# EAGLE design Board_UV V 0.1 (EAGLE 9.5.0)
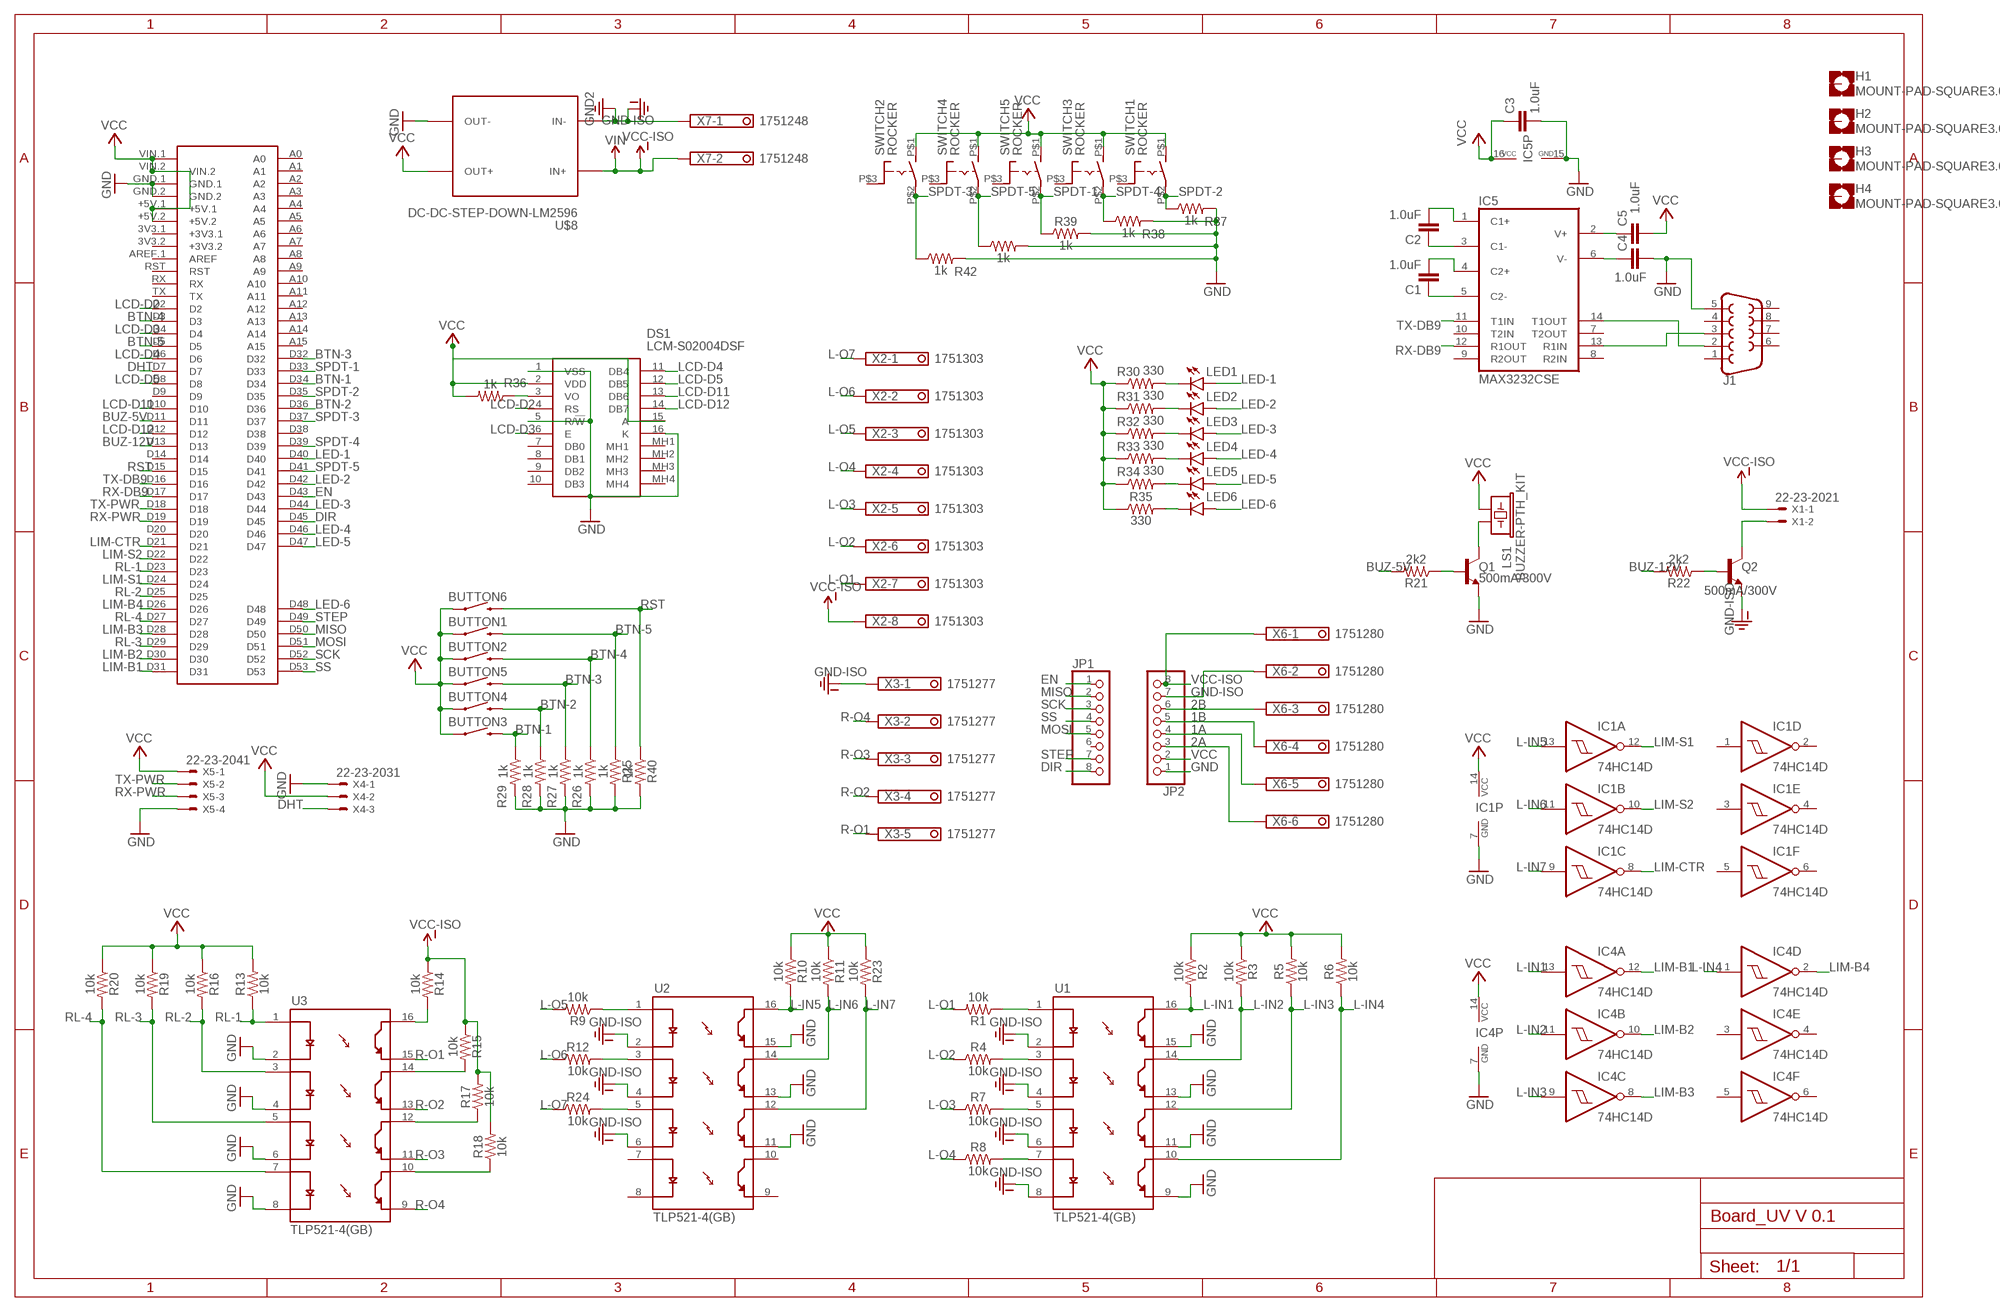
[diagram p0: schematic, sheet 1]

## Parts
BUTTON1  MOMENTARY-SWITCH-SPST-PTH-12MM  [TACTILE_SWITCH_PTH_12MM]
BUTTON2  MOMENTARY-SWITCH-SPST-PTH-12MM  [TACTILE_SWITCH_PTH_12MM]
BUTTON3  MOMENTARY-SWITCH-SPST-PTH-12MM  [TACTILE_SWITCH_PTH_12MM]
BUTTON4  MOMENTARY-SWITCH-SPST-PTH-12MM  [TACTILE_SWITCH_PTH_12MM]
BUTTON5  MOMENTARY-SWITCH-SPST-PTH-12MM  [TACTILE_SWITCH_PTH_12MM]
BUTTON6  MOMENTARY-SWITCH-SPST-PTH-12MM  [TACTILE_SWITCH_PTH_12MM]
C1  1.0uF  1.0UF-0603-16V-10%-X7R  [0603]
C2  1.0uF  1.0UF-0603-16V-10%-X7R  [0603]
C3  1.0uF  1.0UF-0603-16V-10%-X7R  [0603]
C4  1.0uF  1.0UF-0603-16V-10%-X7R  [0603]
C5  1.0uF  1.0UF-0603-16V-10%-X7R  [0603]
DS1  LCM-S02004DSF  [LCMS02004DSF]
H1  MOUNT-PAD-SQUARE3.0  [3,0-PAD-SQUARE]
H2  MOUNT-PAD-SQUARE3.0  [3,0-PAD-SQUARE]
H3  MOUNT-PAD-SQUARE3.0  [3,0-PAD-SQUARE]
H4  MOUNT-PAD-SQUARE3.0  [3,0-PAD-SQUARE]
IC1  74HC14D  [SO14]
IC4  74HC14D  [SO14]
IC5  MAX3232CSE  [SO16]
J1  DB9FEMALE  [DB9]
JP1  PINHD-1X8  [1X08]
JP2  PINHD-1X8  [1X08]
LED1  LED5MM  [LED5MM]
LED2  LED5MM  [LED5MM]
LED3  LED5MM  [LED5MM]
LED4  LED5MM  [LED5MM]
LED5  LED5MM  [LED5MM]
LED6  LED5MM  [LED5MM]
LS1  BUZZER-PTH_KIT  [BUZZER-12MM-KIT]
Q1  500mA/300V  TRANS_NPN-MMBTA42  [SOT23-3]
Q2  500mA/300V  TRANS_NPN-MMBTA42  [SOT23-3]
R1  10k  10KOHM-0603-1/10W-1%  [0603]
R2  10k  10KOHM-0603-1/10W-1%  [0603]
R3  10k  10KOHM-0603-1/10W-1%  [0603]
R4  10k  10KOHM-0603-1/10W-1%  [0603]
R5  10k  10KOHM-0603-1/10W-1%  [0603]
R6  10k  10KOHM-0603-1/10W-1%  [0603]
R7  10k  10KOHM-0603-1/10W-1%  [0603]
R8  10k  10KOHM-0603-1/10W-1%  [0603]
R9  10k  10KOHM-0603-1/10W-1%  [0603]
R10  10k  10KOHM-0603-1/10W-1%  [0603]
R11  10k  10KOHM-0603-1/10W-1%  [0603]
R12  10k  10KOHM-0603-1/10W-1%  [0603]
R13  10k  10KOHM-0603-1/10W-1%  [0603]
R14  10k  10KOHM-0603-1/10W-1%  [0603]
R15  10k  10KOHM-0603-1/10W-1%  [0603]
R16  10k  10KOHM-0603-1/10W-1%  [0603]
R17  10k  10KOHM-0603-1/10W-1%  [0603]
R18  10k  10KOHM-0603-1/10W-1%  [0603]
R19  10k  10KOHM-0603-1/10W-1%  [0603]
R20  10k  10KOHM-0603-1/10W-1%  [0603]
R21  2k2  10KOHM-0603-1/10W-1%  [0603]
R22  2k2  10KOHM-0603-1/10W-1%  [0603]
R23  10k  10KOHM-0603-1/10W-1%  [0603]
R24  10k  10KOHM-0603-1/10W-1%  [0603]
R25  1k  10KOHM-0603-1/10W-1%  [0603]
R26  1k  10KOHM-0603-1/10W-1%  [0603]
R27  1k  10KOHM-0603-1/10W-1%  [0603]
R28  1k  10KOHM-0603-1/10W-1%  [0603]
R29  1k  10KOHM-0603-1/10W-1%  [0603]
R30  330  10KOHM-0603-1/10W-1%  [0603]
R31  330  10KOHM-0603-1/10W-1%  [0603]
R32  330  10KOHM-0603-1/10W-1%  [0603]
R33  330  10KOHM-0603-1/10W-1%  [0603]
R34  330  10KOHM-0603-1/10W-1%  [0603]
R35  330  10KOHM-0603-1/10W-1%  [0603]
R36  1k  10KOHM-0603-1/10W-1%  [0603]
R37  1k  10KOHM-0603-1/10W-1%  [0603]
R38  1k  10KOHM-0603-1/10W-1%  [0603]
R39  1k  10KOHM-0603-1/10W-1%  [0603]
R40  1k  10KOHM-0603-1/10W-1%  [0603]
R41  1k  10KOHM-0603-1/10W-1%  [0603]
R42  1k  10KOHM-0603-1/10W-1%  [0603]
SWITCH1  ROCKER  [320-916]
SWITCH2  ROCKER  [320-916]
SWITCH3  ROCKER  [320-916]
SWITCH4  ROCKER  [320-916]
SWITCH5  ROCKER  [320-916]
U1  TLP521-4(GB)  [DIP762W50P254L2007H485Q16]
U2  TLP521-4(GB)  [DIP762W50P254L2007H485Q16]
U3  TLP521-4(GB)  [DIP762W50P254L2007H485Q16]
U$1  MEGA2560_MIKRO  [MEGA2560_MIKRO]
U$8  DC-DC-STEP-DOWN-LM2596  [DC-DC-STEP-DOWN-LM2596]
X1  22-23-2021  [22-23-2021]
X2  1751303  [1751303]
X3  1751277  [1751277]
X4  22-23-2031  [22-23-2031]
X5  22-23-2041  [22-23-2041]
X6  1751280  [1751280]
X7  1751248  [1751248]

## Nets
1A: JP2.4 X6.5
1B: JP2.5 X6.4
2A: JP2.3 X6.6
2B: JP2.6 X6.3
BTN-1: BUTTON3.3 R29.1 U$1.D34
BTN-2: BUTTON4.3 R28.1 U$1.D36
BTN-3: BUTTON5.3 R27.1 U$1.D32
BTN-4: BUTTON2.3 R26.1 U$1.D3
BTN-5: BUTTON1.3 R25.1 U$1.D5
BUZ-5V: R21.2 U$1.D11
BUZ-12V: R22.2 U$1.D13
DHT: U$1.D7 X4.3
DIR: JP1.8 U$1.D45
EN: JP1.1 U$1.D43
GND: C3.2 C4.2 DS1.1(VSS) DS1.5(R/!W) DS1.16(K) IC1.7(P:GND) IC4.7(P:GND) IC5.15(GND) J1.5 JP2.1 Q1.2(E) R25.2 R26.2 R27.2 R28.2 R29.2 R37.2 R38.2 R39.2 R40.2 R41.2 R42.2 U1.9(ET4) U1.11(ET3) U1.13(ET2) U1.15(ET1) U2.11(ET3) U2.13(ET2) U2.15(ET1) U3.2(C1) U3.4(C2) U3.6(C3) U3.8(C4) U$1.GND.1 U$1.GND.2 U$8.OUT- X4.1 X5.4
GND-ISO: JP2.7 Q2.2(E) U1.2(C1) U1.4(C2) U1.6(C3) U1.8(C4) U2.2(C1) U2.4(C2) U2.6(C3) U$8.IN- X3.1 X6.2 X7.1 ; supply symbol labelled GND2
L-IN1: IC4.13(A:I) R2.2 U1.16(CT1)
L-IN2: IC4.11(B:I) R3.2 U1.14(CT2)
L-IN3: IC4.9(C:I) R5.1 U1.12(CT3)
L-IN4: IC4.1(D:I) R6.1 U1.10(CT4)
L-IN5: IC1.13(A:I) R10.2 U2.16(CT1)
L-IN6: IC1.11(B:I) R11.2 U2.14(CT2)
L-IN7: IC1.9(C:I) R23.2 U2.12(CT3)
L-O1: R1.2 X2.7
L-O2: R4.1 X2.6
L-O3: R7.1 X2.5
L-O4: R8.1 X2.4
L-O5: R9.2 X2.3
L-O6: R12.1 X2.2
L-O7: R24.1 X2.1
LCD-D2: DS1.4(RS) U$1.D2
LCD-D3: DS1.6(E) U$1.D4
LCD-D4: DS1.11(DB4) U$1.D6
LCD-D5: DS1.12(DB5) U$1.D8
LCD-D11: DS1.13(DB6) U$1.D10
LCD-D12: DS1.14(DB7) U$1.D12
LED-1: LED1.A U$1.D40
LED-2: LED2.A U$1.D42
LED-3: LED3.A U$1.D44
LED-4: LED4.A U$1.D46
LED-5: LED5.A U$1.D47
LED-6: LED6.A U$1.D48
LIM-B1: IC4.12(A:O) U$1.D31
LIM-B2: IC4.10(B:O) U$1.D30
LIM-B3: IC4.8(C:O) U$1.D28
LIM-B4: IC4.2(D:O) U$1.D26
LIM-CTR: IC1.8(C:O) U$1.D21
LIM-S1: IC1.12(A:O) U$1.D24
LIM-S2: IC1.10(B:O) U$1.D22
MISO: JP1.2 U$1.D50
MOSI: JP1.5 U$1.D51
N$1: C1.1 IC5.5(C2-)
N$2: C4.1 IC5.6(V-)
N$3: C2.1 IC5.3(C1-)
N$4: C2.2 IC5.1(C1+)
N$5: C1.2 IC5.4(C2+)
N$6: IC5.14(T1OUT) J1.2
N$7: C5.1 IC5.2(V+)
N$8: LED1.K(C) R30.2
N$9: LED4.K(C) R33.2
N$10: IC5.13(R1IN) J1.3
N$13: R1.1 U1.1(A1)
N$14: R4.2 U1.3(A2)
N$15: R7.2 U1.5(A3)
N$16: R8.2 U1.7(A4)
N$23: R9.1 U2.1(A1)
N$24: R12.2 U2.3(A2)
N$25: Q1.1(B) R21.1
N$33: R14.2 U3.16(CT1)
N$37: R15.2 U3.14(CT2)
N$38: R17.1 U3.12(CT3)
N$39: R18.1 U3.10(CT4)
N$42: LS1.- Q1.3(C)
N$47: Q2.3(C) X1.2
N$56: DS1.3(VO) R36.1
N$66: Q2.1(B) R22.1
N$69: R24.2 U2.5(A3)
N$89: LED2.K(C) R31.2
N$91: LED3.K(C) R32.2
N$94: LED5.K(C) R34.2
N$96: LED6.K(C) R35.2
R-O1: U3.15(ET1) X3.5
R-O2: U3.13(ET2) X3.4
R-O3: U3.11(ET3) X3.3
R-O4: U3.9(ET4) X3.2
RL-1: R13.1 U3.1(A1) U$1.D23
RL-2: R16.2 U3.3(A2) U$1.D25
RL-3: R19.2 U3.5(A3) U$1.D29
RL-4: R20.2 U3.7(A4) U$1.D27
RST: BUTTON6.3 R40.1 U$1.D15
RX-DB9: IC5.12(R1OUT) U$1.D17
RX-PWR: U$1.D19 X5.3
SCK: JP1.3 U$1.D52
SPDT-1: R39.1 SWITCH5.P$2(P) U$1.D33
SPDT-2: R37.1 SWITCH1.P$2(P) U$1.D35
SPDT-3: R42.1 SWITCH2.P$2(P) U$1.D37
SPDT-4: R38.1 SWITCH3.P$2(P) U$1.D39
SPDT-5: R41.1 SWITCH4.P$2(P) U$1.D41
SS: JP1.4 U$1.D53
STEP: JP1.7 U$1.D49
TX-DB9: IC5.11(T1IN) U$1.D16
TX-PWR: U$1.D18 X5.2
VCC: BUTTON1.1 BUTTON2.1 BUTTON3.1 BUTTON4.1 BUTTON5.1 BUTTON6.1 C3.1 C5.2 DS1.2(VDD) DS1.15(A) IC1.14(P:VCC) IC4.14(P:VCC) IC5.16(VCC) JP2.2 LS1.+ R2.1 R3.1 R5.2 R6.2 R10.1 R11.1 R13.2 R16.1 R19.1 R20.1 R23.1 R30.1 R31.1 R32.1 R33.1 R34.1 R35.1 R36.2 SWITCH1.P$1(S) SWITCH2.P$1(S) SWITCH3.P$1(S) SWITCH4.P$1(S) SWITCH5.P$1(S) U$1.+5V.1 U$1.+5V.2 U$1.VIN.1 U$1.VIN.2 U$8.OUT+ X4.2 X5.1
VCC-ISO: JP2.8 R14.1 R15.1 R17.2 R18.2 U$8.IN+ X1.1 X2.8 X6.1 X7.2 ; supply symbol labelled VIN
Unconnected: DS1.7(DB0) DS1.8(DB1) DS1.9(DB2) DS1.10(DB3) DS1.MH1 DS1.MH2 DS1.MH3 DS1.MH4 H1.B3,0(MOUNT) H2.B3,0(MOUNT) H3.B3,0(MOUNT) H4.B3,0(MOUNT) IC1.1(D:I) IC1.2(D:O) IC1.3(E:I) IC1.4(E:O) IC1.5(F:I) IC1.6(F:O) IC4.3(E:I) IC4.4(E:O) IC4.5(F:I) IC4.6(F:O) IC5.7(T2OUT) IC5.8(R2IN) IC5.9(R2OUT) IC5.10(T2IN) J1.1 J1.4 J1.6 J1.7 J1.8 J1.9 JP1.6 SWITCH1.P$3(NC) SWITCH2.P$3(NC) SWITCH3.P$3(NC) SWITCH4.P$3(NC) SWITCH5.P$3(NC) U2.7(A4) U2.8(C4) U2.9(ET4) U2.10(CT4) U$1.3V3.1(+3V3.1) U$1.3V3.2(+3V3.2) U$1.A0 U$1.A1 U$1.A2 U$1.A3 U$1.A4 U$1.A5 U$1.A6 U$1.A7 U$1.A8 U$1.A9 U$1.A10 U$1.A11 U$1.A12 U$1.A13 U$1.A14 U$1.A15 U$1.AREF.1(AREF) U$1.D9 U$1.D14 U$1.D20 U$1.D38 U$1.RST U$1.RX U$1.TX

## Library data of the parts
BUTTON1-BUTTON6 = SparkFun-Switches:MOMENTARY-SWITCH-SPST: Momentary Switch (Pushbutton) - SPST Normally-open (NO) SPST momentary switches (buttons, pushbuttons). Variants PTH-12MM - 12mm square, through-hole Momentary Pushbutton Switch - 12mm Square <https://www.sparkfun.com/products/9190> (COM-09190) PTH-6.0MM, PTH-6.0MM-KIT - 6.0mm square, through-hole Mini Pushbutton Switch <https://www.sparkfun.com/products/97> (COM-00097) KIT package intended for soldering kit's - only one side of pads' copper is exposed. PTH-RIGHT-ANGLE-KIT - Right-angle, through-hole Right Angle Tactile Button <https://www.sparkfun.com/products/10791> - Used on SparkFun BigTime Watch Kit <https://www.sparkfun.com/products/11734> SMD-12MM - 12mm square, surface-mount Tactile Button - SMD (12mm) <https://www.sparkfun.com/products/12993> (COM-12993) Used on SparkFun PicoBoard <https://www.sparkfun.com/products/11888> SMD-4.5MM - 4.5mm Square Trackball Switch Used on SparkFun Blackberry Trackballer Breakout <https://www.sparkfun.com/products/13169> SMD-4.6MMX2.8MM - 4.60mm x 2.80mm, surface mount Used on SparkFun SAMD21 Mini Breakout <https://www.sparkfun.com/products/13664> SMD-5.2MM, SMD-5.2-REDUNDANT - 5.2mm square, surface-mount Mini Pushbutton Switch - SMD <https://www.sparkfun.com/products/8720> (COM-08720) Used on Arduino Pro Mini <https://www.sparkfun.com/products/11114> REDUNDANT package connects both switch circuits together SMD-6.0X3.5MM - 6.0 x 3.5mm, surface mount Momentary Reset Switch SMD <https://www.sparkfun.com/products/8229> (COM-08229) SMD-6.2MM-TALL - 6.2mm square, surface mount Tactile Button - SMD (6mm) <https://www.sparkfun.com/products/12992> Used on SparkFun Digital Sandbox <https://www.sparkfun.com/products/12651> SMD-RIGHT-ANGLE - Right-angle, surface mount Used on SparkFun Block for Intel® Edison - Arduino <https://www.sparkfun.com/products/13036>; PROD_ID: SWCH-09185; SF_SKU: COM-09190
C1-C5 = SparkFun-Capacitors:1.0UF: 1µF ceramic capacitors A capacitor is a passive two-terminal electrical component used to store electrical energy temporarily in an electric field.; PROD_ID: CAP-13930
DS1 = LCM-S02004DSF:LCM-S02004DSF: Lumex LCM-S02004DSF Alphanumeric LCD Display, 4 Rows by 20 Characters, Transflective Source: Datasheet <https://media.digikey.com/pdf/Data Sheets/Lumex PDFs/LCM-x02004Dxx_Dwg.PDF>; ALLIED_NUMBER: 70127579; ALLIED_PRICE-STOCK: https://www.alliedelec.com/lumex-lcm-s02004dsf/70127579/; DESCRIPTION: Lumex LCM-S02004DSF Alphanumeric LCD Display, 4 Rows by 20 Characters, Transflective; HEIGHT: 10.3mm; MANUFACTURER_NAME: Lumex; MANUFACTURER_PART_NUMBER: LCM-S02004DSF; MOUSER_PART_NUMBER: 696-LCM-S02004DSF; MOUSER_PRICE-STOCK: https://www.mouser.com/Search/Refine.aspx?Keyword=696-LCM-S02004DSF; RS_PART_NUMBER: 8885720; RS_PRICE-STOCK: http://uk.rs-online.com/web/p/products/8885720
H1-H4 = holes:MOUNT-PAD-SQUARE: MOUNTING PAD, square
IC1 IC4 = 74xx-eu:74*14: Hex schmitt trigger INVERTER
IC5 = maxim:MAX3232*: True RS-232 Transceivers 3.0V to 5.5V, Low-Power up to 1Mbps, Using Four 0.1µF External Capacitors Source: http://pdfserv.maxim-ic.com/en/ds/MAX3222-MAX3241.pdf; MPN: MAX3232CSE; OC_FARNELL: 9725490; OC_NEWARK: 90C2890
J1 = SparkFun-Connectors:DB9: DB9 Connector Standard DB9 (D-Sub 9) serial connector. Can be used for CAN bus as well as RS485 and RS232. Footprint production proven. Here is the female version connector we sell at SparkFun: 9 Pin Female Serial Connector - PCB Mount <https://www.sparkfun.com/products/429> (PRT-00429) This connector has been used on the following SparkFun products: SparkFun RS232 Shifter - SMD <https://www.sparkfun.com/products/449> (PRT-00449) SparkFun RS232 Shifter SMD (No DB9) <https://www.sparkfun.com/products/8780> (PRT-08780); PROD_ID: CONN-08194
JP1 JP2 = pinhead:PINHD-1X8: PIN HEADER
LED1-LED6 = led:LED: LED OSRAM: - CHIPLED LG R971, LG N971, LY N971, LG Q971, LY Q971, LO R971, LY R971 LH N974, LH R974 LS Q976, LO Q976, LY Q976 LO Q996 - Hyper CHIPLED LW Q18S LB Q993, LB Q99A, LB R99A - SideLED LS A670, LO A670, LY A670, LG A670, LP A670 LB A673, LV A673, LT A673, LW A673 LH A674 LY A675 LS A676, LA A676, LO A676, LY A676, LW A676 LS A679, LY A679, LG A679 - Hyper Micro SIDELED® LS Y876, LA Y876, LO Y876, LY Y876 LT Y87S - SmartLED LW L88C, LW L88S LB L89C, LB L89S, LG L890 LS L89K, LO L89K, LY L89K LS L896, LA L896, LO L896, LY L896 - TOPLED LS T670, LO T670, LY T670, LG T670, LP T670 LSG T670, LSP T670, LSY T670, LOP T670, LYG T670 LG T671, LOG T671, LSG T671 LB T673, LV T673, LT T673, LW T673 LH T674 LS T676, LA T676, LO T676, LY T676, LB T676, LH T676, LSB T676, LW T676 LB T67C, LV T67C, LT T67C, LS T67K, LO T67K, LY T67K, LW E67C LS E67B, LA E67B, LO E67B, LY E67B, LB E67C, LV E67C, LT E67C LW T67C LS T679, LY T679, LG T679 LS T770, LO T770, LY T770, LG T770, LP T770 LB T773, LV T773, LT T773, LW T773 LH T774 LS E675, LA E675, LY E675, LS T675 LS T776, LA T776, LO T776, LY T776, LB T776 LHGB T686 LT T68C, LB T68C - Hyper Mini TOPLED® LB M676 - Mini TOPLED Santana® LG M470 LS M47K, LO M47K, LY M47K Source: http://www.osram.convergy.de LUXEON: - LUMILED® LXK2-PW12-R00, LXK2-PW12-S00, LXK2-PW14-U00, LXK2-PW14-V00 LXK2-PM12-R00, LXK2-PM12-S00, LXK2-PM14-U00 LXK2-PE12-Q00, LXK2-PE12-R00, LXK2-PE12-S00, LXK2-PE14-T00, LXK2-PE14-U00 LXK2-PB12-K00, LXK2-PB12-L00, LXK2-PB12-M00, LXK2-PB14-N00, LXK2-PB14-P00, LXK2-PB14-Q00 LXK2-PR12-L00, LXK2-PR12-M00, LXK2-PR14-Q00, LXK2-PR14-R00 LXK2-PD12-Q00, LXK2-PD12-R00, LXK2-PD12-S00 LXK2-PH12-R00, LXK2-PH12-S00 LXK2-PL12-P00, LXK2-PL12-Q00, LXK2-PL12-R00 Source: www.luxeon.com KINGBRIGHT: KA-3528ASYC Source: www.kingbright.com
LS1 = SparkFun-Electromechanical:BUZZER: Buzzer Small round buzzers that operate around the audible 2kHz range. You can use these as speakers to create simple music or user interfaces. Variant Overview: PTH - Mini Speaker - PC Mount 12mm 2.048kHz <https://www.sparkfun.com/products/7950> PTH_KIT - Mini Speaker - PC Mount 12mm 2.048kHz <https://www.sparkfun.com/products/7950> KIT simplifies soldering by adding stop mask to one side of the pads. PTH_NO_SILK - Mini Speaker - PC Mount 12mm 2.048kHz <https://www.sparkfun.com/products/7950> No silkscreen indicator of buzzer outline. PTH_KIT_NO_SILK - Mini Speaker - PC Mount 12mm 2.048kHz <https://www.sparkfun.com/products/7950> KIT package w/o silkscreen SMD - Buzzer Audio Magnetic (CCV-084B16) SMD buzzer used on, e.g. the LilyPad Buzzer <https://www.sparkfun.com/products/8463> and RFID USB Reader <https://www.sparkfun.com/products/9963>. SMD_KIT - Buzzer Audio Magnetic (CCV-084B16) SMD Buzzer with elongated pins to make soldering easier. Used on the SparkFun Simon Says - Surface Mount Soldering Kit <https://www.sparkfun.com/products/10935>.; PROD_ID: COMP-08253; SF_SKU: COM-07950
Q1 Q2 = SparkFun-DiscreteSemi:TRANS_NPN: NPN transistor Current controlled devices typically used to amplify current or used as a switch. BC547 - COM-08928 <http://www.sparkfun.com/products/8928> (TO-92 45V 100mA) (1.Collector 2.Base 3.Emitter) 2N3904 - COM-00521 <http://www.sparkfun.com/products/521> (TO-92 40V 200mA) (1.Emitter 2.Base 3.Collector) P2N2222A - COM-12852 <http://www.sparkfun.com/products/12852> (TO-92 40V 600mA) (1.Collector 2.Base 3.Emitter); PROD_ID: TRANS-09116
R1-R20 R23 R24 = SparkFun-Resistors:10KOHM: 10kΩ resistor A resistor is a passive two-terminal electrical component that implements electrical resistance as a circuit element. Resistors act to reduce current flow, and, at the same time, act to lower voltage levels within circuits. - Wikipedia; PROD_ID: RES-00824
R21 R22 R25-R42 = SparkFun-Resistors:10KOHM: 10kΩ resistor A resistor is a passive two-terminal electrical component that implements electrical resistance as a circuit element. Resistors act to reduce current flow, and, at the same time, act to lower voltage levels within circuits. - Wikipedia; PROD_ID: RES-00824; VALUE: 10k
SWITCH1-SWITCH5 = rocker sw:ROCKER
U1-U3 = TLP521-4_GB_:TLP521-4(GB): Optocoupler, Quad, Transistor o/p; AVAILABILITY: Unavailable; DESCRIPTION: Optocoupler, Quad, Transistor o/p; MF: Toshiba; MP: TLP521-4_GB_; PACKAGE: DIP-16 Toshiba; PRICE: None
U$1 = MIKRO_MEGA2560:MEGA2560_MIKRO: Arduino Mega2560 pro robotDyn, create by mikroavr.com
U$8 = diy-modules:DC-DC-STEP-DOWN-LM2596: DC/DC Step-Down Regulator based on LM2596-ADJ chip LM2596 datasheet available here: http://www.ti.com/lit/ds/symlink/lm2596.pdf Click here to find device on ebay.com <http://www.ebay.com/sch/lm2596+power+regulator>
X1 = con-molex:22-23-2021: .100" (2.54mm) Center Header - 2 Pin; MF: MOLEX; MPN: 22-23-2021; OC_FARNELL: 1462926; OC_NEWARK: 25C3832
X2 = con-phoenix-350:1751303: MKDS 1/ 8-3,5 Printklemme Nennstrom: 10 A Bemessungsspannung: 160 V Raster: 3,5 mm Polzahl: 8 Montageart: Löten Anschlussart: Schraubanschluss Anschlussrichtung vom Leiter zur Platine: 0° Source: http://eshop.phoenixcontact.com .. .pdf; OC_FARNELL: unknown; OC_NEWARK: unknown
X3 = con-phoenix-350:1751277: MKDS 1/ 5-3,5 Printklemme Nennstrom: 10 A Bemessungsspannung: 160 V Raster: 3,5 mm Polzahl: 5 Montageart: Löten Anschlussart: Schraubanschluss Anschlussrichtung vom Leiter zur Platine: 0° Source: http://eshop.phoenixcontact.com .. 1751277.pdf; OC_FARNELL: unknown; OC_NEWARK: unknown
X4 = con-molex:22-23-2031: .100" (2.54mm) Center Header - 3 Pin; MF: MOLEX; MPN: 22-23-2031; OC_FARNELL: 1462950; OC_NEWARK: 30C0862
X5 = con-molex:22-23-2041: .100" (2.54mm) Center Header - 4 Pin; MF: MOLEX; MPN: 22-23-2041; OC_FARNELL: 1462920; OC_NEWARK: 38C0355
X6 = con-phoenix-350:1751280: MKDS 1/ 6-3,5 Printklemme Nennstrom: 10 A Bemessungsspannung: 160 V Raster: 3,5 mm Polzahl: 6 Montageart: Löten Anschlussart: Schraubanschluss Anschlussrichtung vom Leiter zur Platine: 0° Source: http://eshop.phoenixcontact.com .. 1751280.pdf; MPN: 1751280; OC_FARNELL: unknown; OC_NEWARK: 27R1765
X7 = con-phoenix-350:1751248: MKDS 1/ 2-3,5 Printklemme Nennstrom: 10 A Bemessungsspannung: 160 V Raster: 3,5 mm Polzahl: 2 Montageart: Löten Anschlussart: Schraubanschluss Anschlussrichtung vom Leiter zur Platine: 0° Source: http://eshop.phoenixcontact.com .. 1751248.pdf; OC_FARNELL: unknown; OC_NEWARK: unknown

## Board
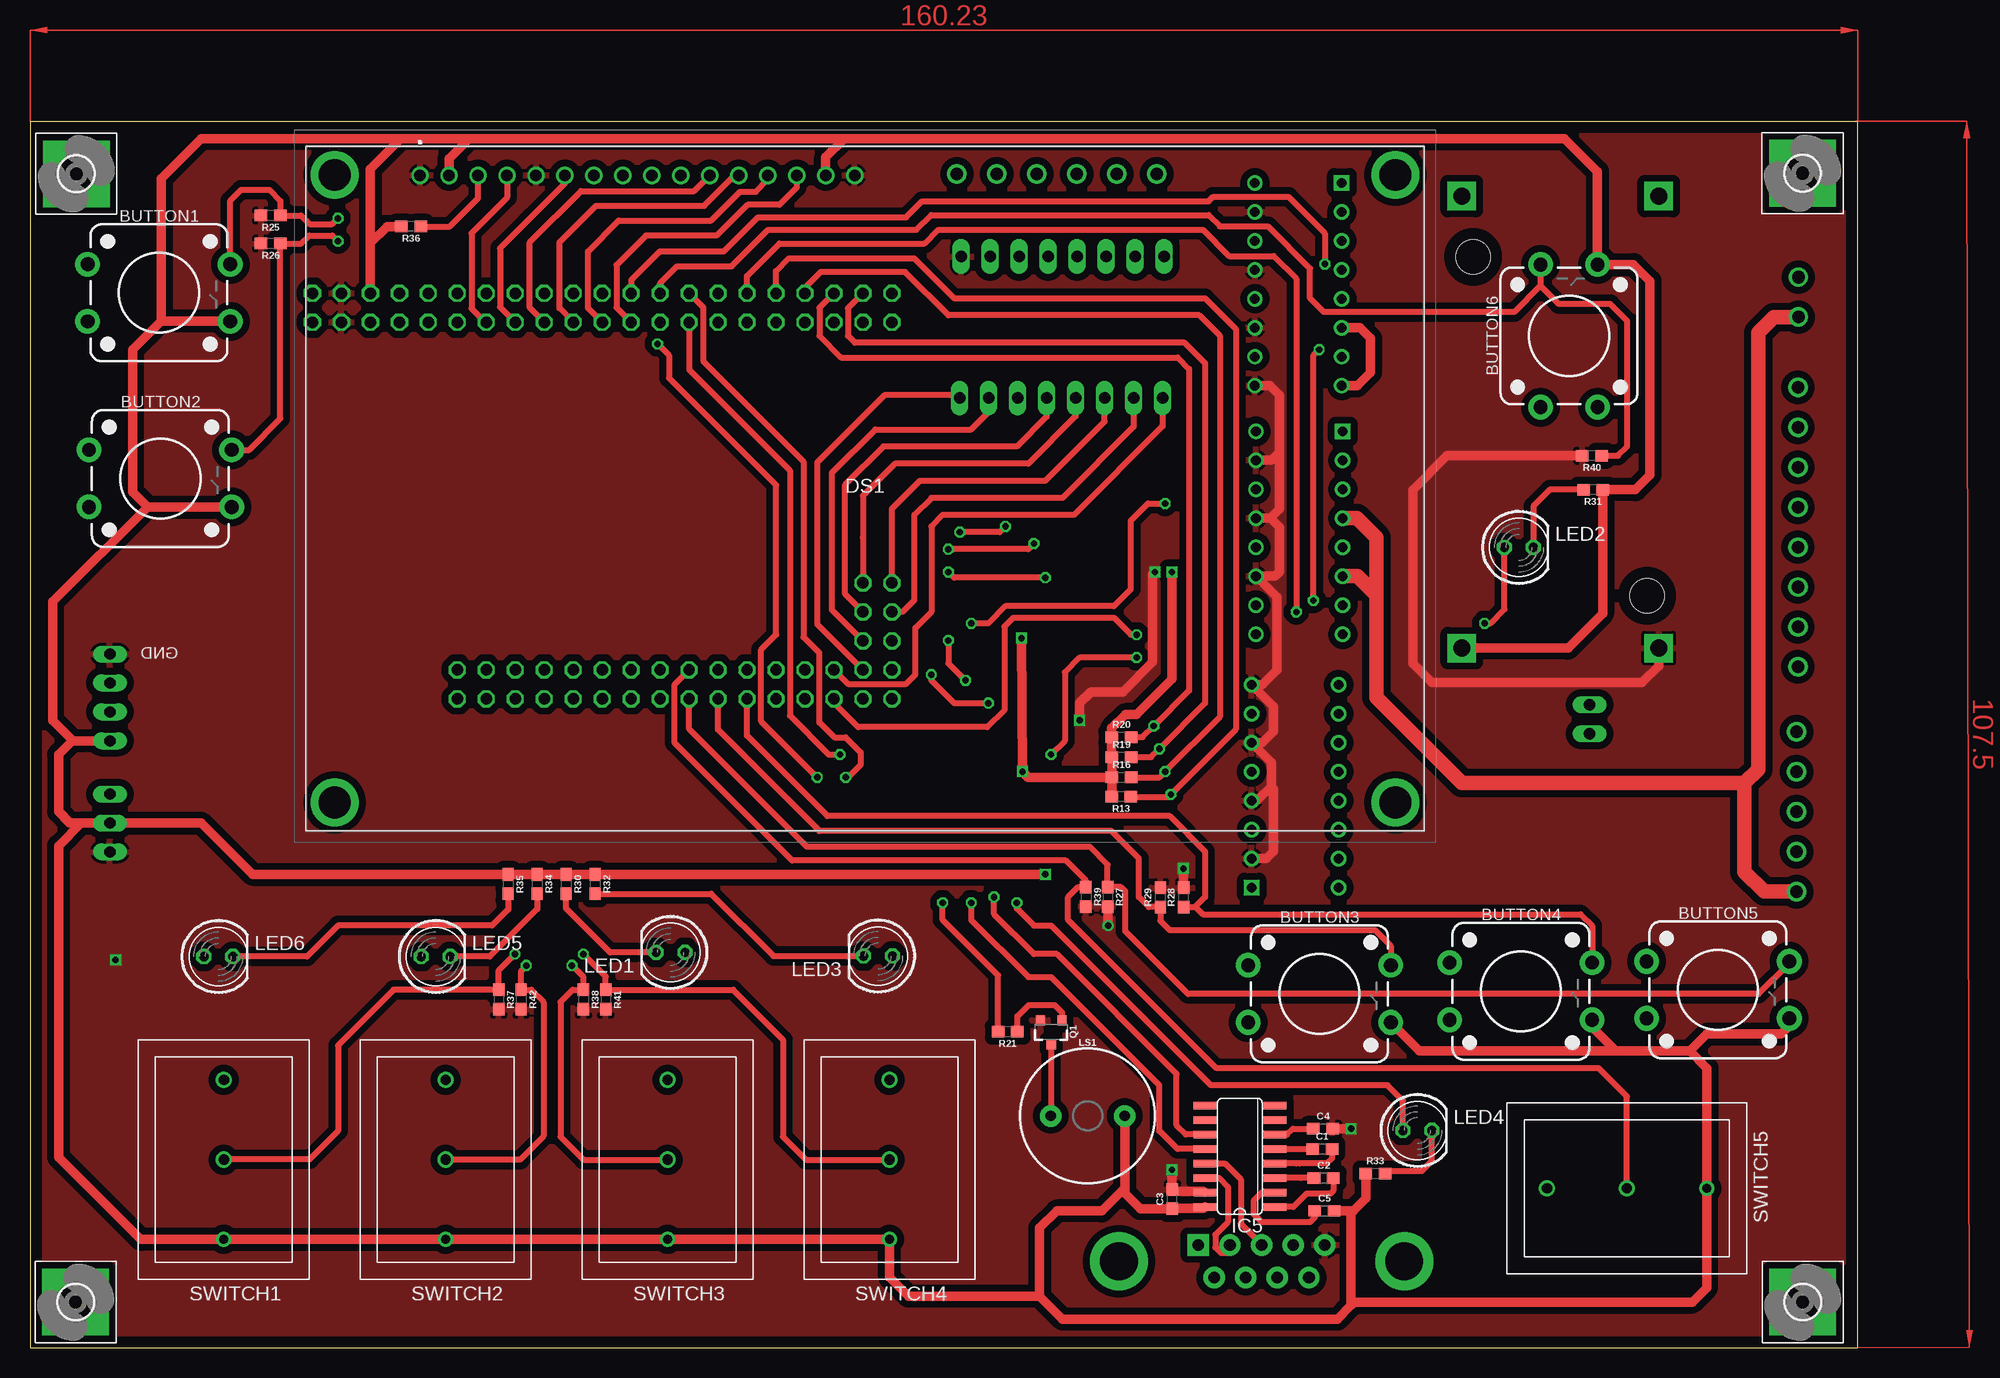
[diagram p1: board, top side]
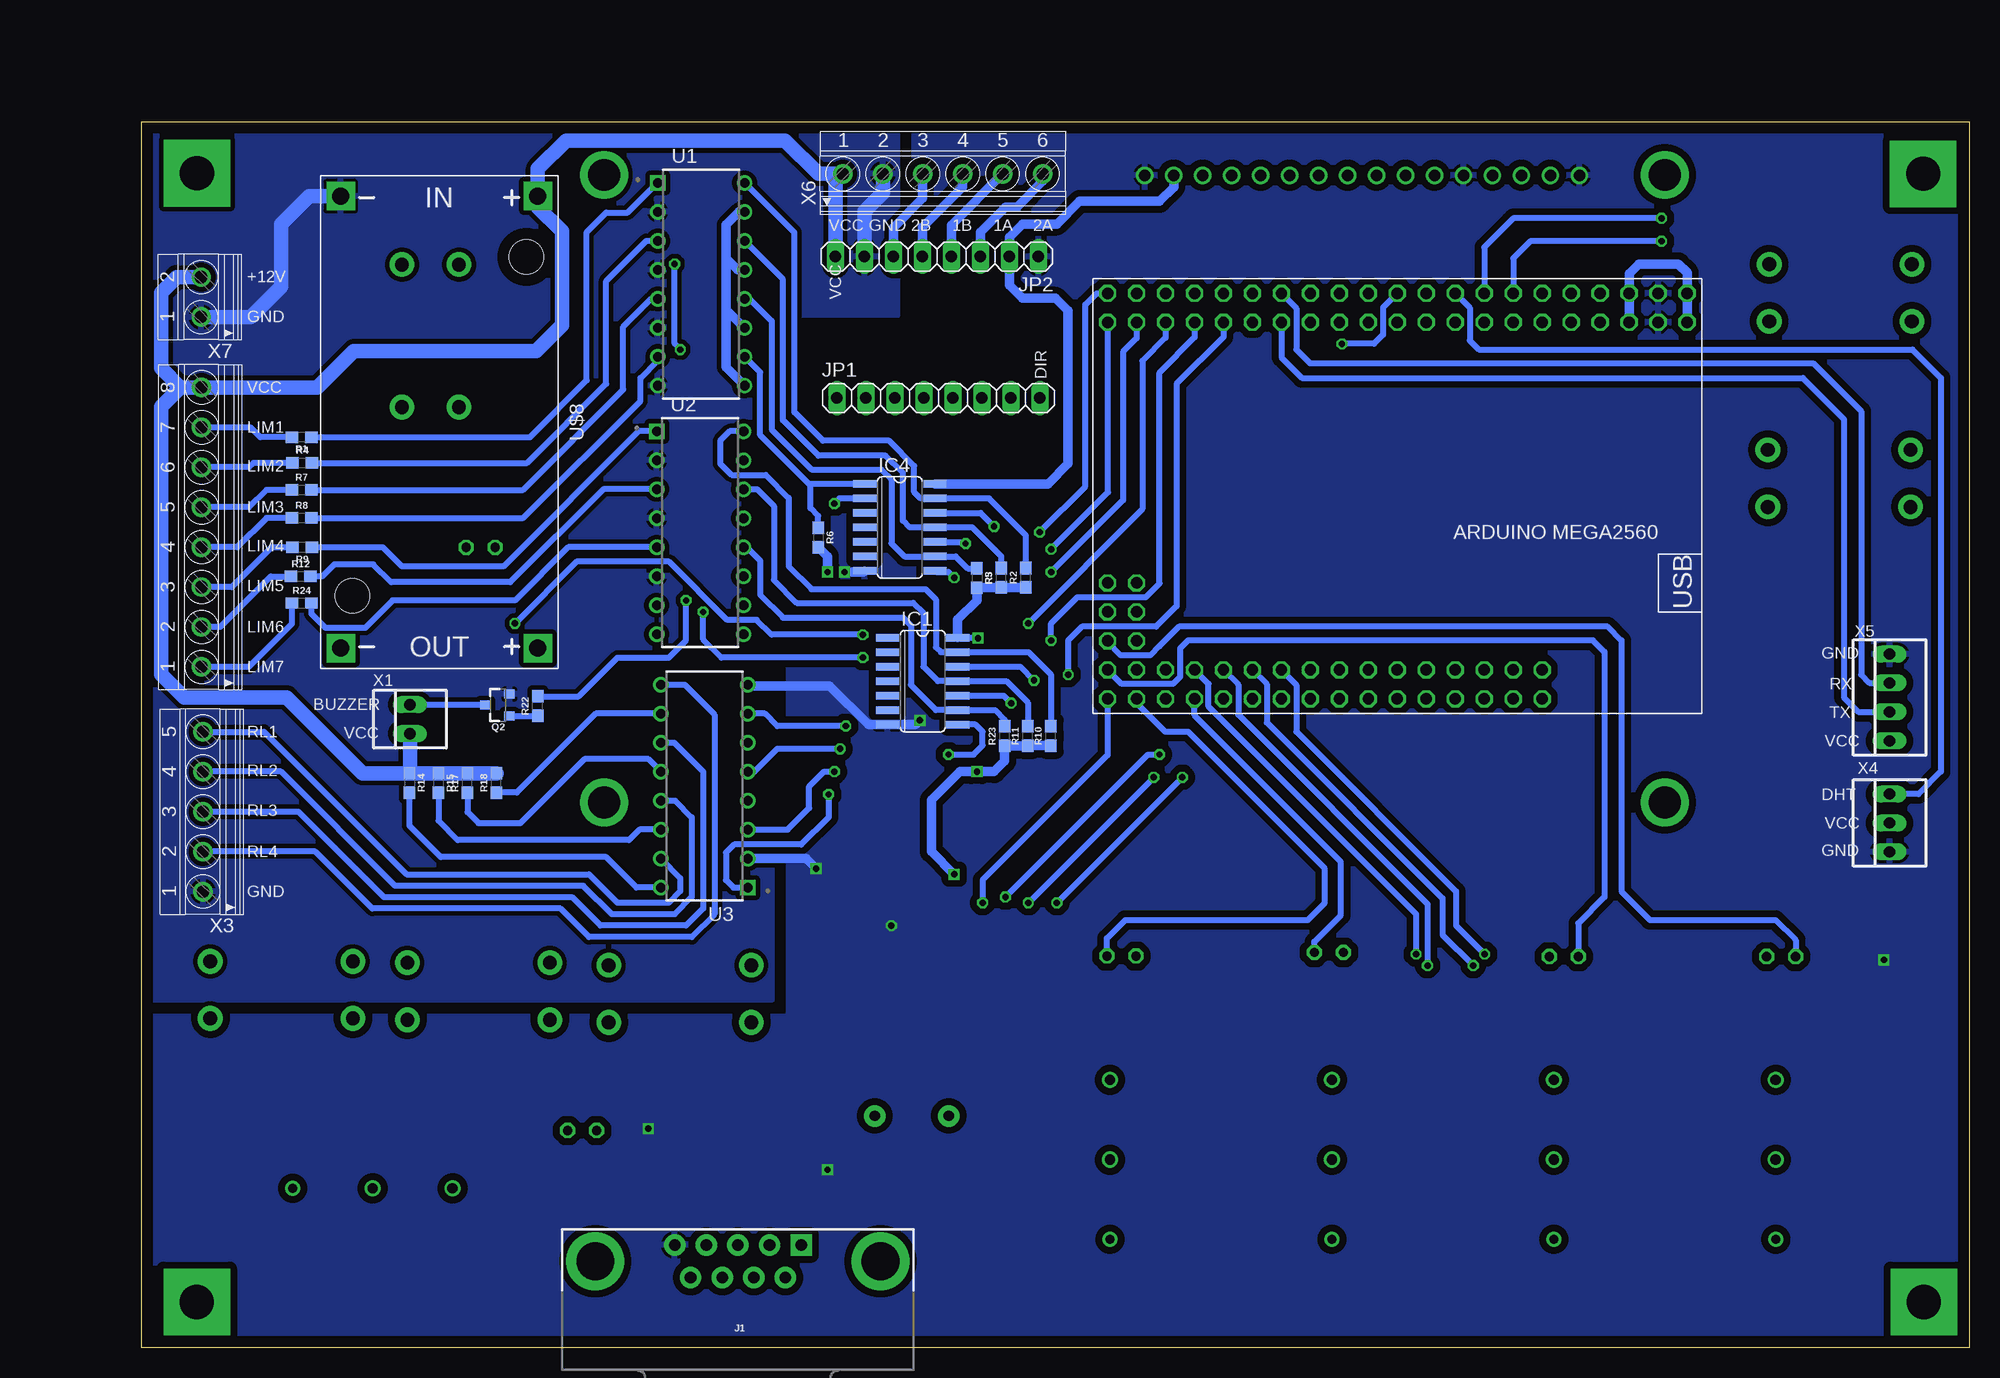
[diagram p2: board, bottom side, seen from below]

Size 160.23 x 107.48 mm. Coordinates in mm from the lower left corner, seen from the top.
Outline: 0,0 160.23,0 160.23,107.48 0,107.48 0,0
Copper layers (1*16): Top 0.035mm / dielectric 1.5mm / Bottom 0.035mm
Design rules "Multikarya *": minimum track width 0.2mm, minimum drill 0.5mm, track to track 0.2mm, track to pad 0.2mm, pad to pad 0.2mm, via to via 0.2mm, smd to smd 0.2mm, copper to edge 40mil, drill to drill 6mil, minimum pad ring 10mil, minimum via ring 8mil, stop-mask expansion 4mil, vias tented up to drill 0mil, thermal gap 10mil

### Footprints (pad centres in the part's own frame; a part is rotated, then mirrored left to right if it is on the bottom)
TACTILE_SWITCH_PTH_12MM = drill 1.2 pad 2.159: 1 6.25,-2.5; 2 -6.25,-2.5; 3 6.25,2.5; 4 -6.25,2.5
0603 = smd 1.1 x 1: 1 -0.85,0; 2 0.85,0
LCMS02004DSF = drill 1 pad 1.5: 1 0,0; 2 2.54,0; 3 5.08,0; 4 7.62,0; 5 10.16,0; 6 12.7,0; 7 15.24,0; 8 17.78,0; 9 20.32,0; 10 22.86,0; 11 25.4,0; 12 27.94,0; 13 30.48,0; 14 33.02,0; 15 35.56,0; 16 38.1,0 | drill 2.8 pad 4.2: MH1 -7.5,0.04; MH2 -7.5,-54.96; MH3 85.5,-54.96; MH4 85.5,0.04
3,0-PAD-SQUARE = drill 3 pad 5.842 square: B3,0 0,0
SO14 = smd 0.66 x 2.032: 1 -3.81,-3.073; 2 -2.54,-3.073; 3 -1.27,-3.073; 4 0,-3.073; 5 1.27,-3.073; 6 2.54,-3.073; 7 3.81,-3.073; 8 3.81,3.073; 9 2.54,3.073; 10 1.27,3.073; 11 0,3.073; 12 -1.27,3.073; 13 -2.54,3.073; 14 -3.81,3.073
SO16 = smd 0.66 x 2.032: 1 -4.445,-3.073; 2 -3.175,-3.073; 3 -1.905,-3.073; 4 -0.635,-3.073; 5 0.635,-3.073; 6 1.905,-3.073; 7 3.175,-3.073; 8 4.445,-3.073; 9 4.445,3.073; 10 3.175,3.073; 11 1.905,3.073; 12 0.635,3.073; 13 -0.635,3.073; 14 -1.905,3.073; 15 -3.175,3.073; 16 -4.445,3.073
DB9 = drill 1.016 pad 1.88 square: 1 -5.54,-1.42 | drill 1.016 pad 1.88: 2 -2.77,-1.42; 3 0,-1.42; 4 2.77,-1.42; 5 5.54,-1.42; 6 -4.15,1.42; 7 -1.38,1.42; 8 1.38,1.42; 9 4.15,1.42 | drill 3.302 pad 5.08: G1 -12.5,0; G2 12.5,0
1X08 = drill 1.016 long: 1 -8.89,0; 2 -6.35,0; 3 -3.81,0; 4 -1.27,0; 5 1.27,0; 6 3.81,0; 7 6.35,0; 8 8.89,0
LED5MM = drill 0.813 octagon: A -1.27,0; K 1.27,0
BUZZER-12MM-KIT = drill 0.9 pad 1.88: + 3.25,0; - -3.25,0
SOT23-3 = smd 0.8 x 0.9: 1 -0.95,-1; 2 0.95,-1; 3 0,1.1
320-916 = drill 0.8: P$1 0,7 | drill 0.9: P$2 0,0; P$3 0,-7
DIP762W50P254L2007H485Q16 = drill 0.84 square: 1 -3.81,8.89 | drill 0.84: 2 -3.81,6.35; 3 -3.81,3.81; 4 -3.81,1.27; 5 -3.81,-1.27; 6 -3.81,-3.81; 7 -3.81,-6.35; 8 -3.81,-8.89; 9 3.81,-8.89; 10 3.81,-6.35; 11 3.81,-3.81; 12 3.81,-1.27; 13 3.81,1.27; 14 3.81,3.81; 15 3.81,6.35; 16 3.81,8.89
MEGA2560_MIKRO = drill 1 octagon: 3V3.1 -26.67,-17.78; 3V3.2 -26.67,-20.32; +5V.1 -29.21,-17.78; +5V.2 -29.21,-20.32; A0 -21.59,15.24; A1 -21.59,12.7; A2 -19.05,15.24; A3 -19.05,12.7; A4 -16.51,15.24; A5 -16.51,12.7; A6 -13.97,15.24; A7 -13.97,12.7; A8 -11.43,15.24; A9 -11.43,12.7; A10 -8.89,15.24; A11 -8.89,12.7; A12 -6.35,15.24; A13 -6.35,12.7; A14 -3.81,15.24; A15 -3.81,12.7; AREF.1 -24.13,-17.78; D2 -19.05,-17.78; D3 -19.05,-20.32; D4 -16.51,-17.78; D5 -16.51,-20.32; D6 -13.97,-17.78; D7 -13.97,-20.32; D8 -11.43,-17.78; D9 -11.43,-20.32; D10 -8.89,-17.78; D11 -8.89,-20.32; D12 -6.35,-17.78; D13 -6.35,-20.32; D14 -3.81,-17.78; D15 -3.81,-20.32; D16 -1.27,-17.78; D17 -1.27,-20.32; D18 1.27,-17.78; D19 1.27,-20.32; D20 3.81,-17.78; D21 3.81,-20.32; D22 6.35,-17.78; D23 6.35,-20.32; D24 8.89,-17.78; D25 8.89,-20.32; D26 11.43,-17.78; D27 11.43,-20.32; D28 13.97,-17.78; D29 13.97,-20.32; D30 16.51,-17.78; D31 16.51,-20.32; D32 -1.27,15.24; D33 -1.27,12.7; D34 1.27,15.24; D35 1.27,12.7; D36 3.81,15.24; D37 3.81,12.7; D38 6.35,15.24; D39 6.35,12.7; D40 8.89,15.24; D41 8.89,12.7; D42 11.43,15.24; D43 11.43,12.7; D44 13.97,15.24; D45 13.97,12.7; D46 16.51,15.24; D47 16.51,12.7; D48 16.51,10.16; D49 13.97,10.16; D50 16.51,7.62; D51 13.97,7.62; D52 16.51,5.08; D53 13.97,5.08; GND.1 -31.75,-17.78; GND.2 -31.75,-20.32; RST -24.13,-20.32; RX -21.59,-17.78; TX -21.59,-20.32; VIN.1 -34.29,-17.78; VIN.2 -34.29,-20.32
DC-DC-STEP-DOWN-LM2596 = drill 1.5 pad 2.5 square: IN+ -19.812,8.636; IN- -19.812,-8.636; OUT+ 19.812,8.636; OUT- 19.812,-8.636 | hole 3: -14.478,7.62; 15.24,-7.62
22-23-2021 = drill 1 long: 1 -1.27,0; 2 1.27,0
1751303 = drill 1.1 pad 1.7: 1 -12.25,-0.1; 2 -8.75,-0.1; 3 -5.25,-0.1; 4 -1.75,-0.1; 5 1.75,-0.1; 6 5.25,-0.1; 7 8.75,-0.1; 8 12.25,-0.1
1751277 = drill 1.1 pad 1.7: 1 -7,-0.1; 2 -3.5,-0.1; 3 0,-0.1; 4 3.5,-0.1; 5 7,-0.1
22-23-2031 = drill 1 long: 1 -2.54,0; 2 0,0; 3 2.54,0
22-23-2041 = drill 1 long: 1 -3.81,0; 2 -1.27,0; 3 1.27,0; 4 3.81,0
1751280 = drill 1.1 pad 1.7: 1 -8.75,-0.1; 2 -5.25,-0.1; 3 -1.75,-0.1; 4 1.75,-0.1; 5 5.25,-0.1; 6 8.75,-0.1
1751248 = drill 1.1 pad 1.7: 1 -1.75,-0.1; 2 1.75,-0.1

### Placement (x,y rotation side)
BUTTON1  11.3,92.48 0 top
BUTTON2  11.43,76.2 0 top
BUTTON3  113.03,31.02 0 top
BUTTON4  130.68,31.24 0 top
BUTTON5  147.96,31.37 0 top
BUTTON6  134.9,88.7 90 top
C1  113.27,17.43 0 top
C2  113.39,14.88 0 top
C3  100.14,13.03 90 top
C4  113.33,19.2 0 top
C5  113.47,12 0 top
DS1  34.19,102.77 0 top
H1  4,4 0 top
H2  155.38,4 0 top
H3  4.06,102.91 0 top
H4  155.37,102.96 0 top
IC1  91.76,58.43 270 bottom
IC4  93.76,71.9 270 bottom
IC5  106.05,16.78 90 top
J1  107.95,7.58 180 bottom
JP1  90.38,83.25 0 bottom
JP2  90.52,95.66 180 bottom
LED1  56.15,34.65 180 top
LED2  130.51,70.16 0 top
LED3  74.34,34.34 180 top
LED4  121.61,19.04 0 top
LED5  35.56,34.29 0 top
LED6  16.51,34.29 0 top
LS1  92.71,20.32 0 top
Q1  89.51,27.7 180 top
Q2  128.98,56.34 90 bottom
R1  146.2,79.82 180 bottom
R2  82.71,67.5 90 bottom
R3  84.86,67.5 90 bottom
R4  146.16,77.57 0 bottom
R5  87,67.47 270 bottom
R6  100.91,71.03 270 bottom
R7  146.2,75.2 0 bottom
R8  146.2,72.74 0 bottom
R9  146.15,70.15 180 bottom
R10  80.53,53.62 90 bottom
R11  82.54,53.62 90 bottom
R12  146.28,67.61 0 bottom
R13  95.65,48.3 180 top
R14  136.74,49.51 270 bottom
R15  134.2,49.51 270 bottom
R16  95.67,50.01 0 top
R17  131.66,49.51 90 bottom
R18  129.12,49.51 90 bottom
R19  95.67,51.77 0 top
R20  95.66,53.53 0 top
R21  85.7,27.7 180 top
R22  125.5,56.24 90 bottom
R23  84.57,53.62 90 bottom
R24  146.2,65.28 0 bottom
R25  21.1,99.25 180 top
R26  21.1,96.79 180 top
R27  94.46,39.52 270 top
R28  101.12,39.48 90 top
R29  99.08,39.48 90 top
R30  46.99,40.64 270 top
R31  137.01,75.22 180 top
R32  49.53,40.64 270 top
R33  117.93,15.28 0 top
R34  44.45,40.64 270 top
R35  41.91,40.64 270 top
R36  33.4,98.29 180 top
R37  41.09,30.52 270 top
R38  48.51,30.52 270 top
R39  92.55,39.52 270 top
R40  136.9,78.2 180 top
R41  50.47,30.52 270 top
R42  43.05,30.52 270 top
SWITCH1  16.99,16.49 180 top
SWITCH2  36.44,16.49 180 top
SWITCH3  55.89,16.49 180 top
SWITCH4  75.34,16.49 180 top
SWITCH5  139.97,13.97 270 top
U1  111.17,93.23 0 bottom
U2  111.26,71.44 0 bottom
U3  110.89,49.23 180 bottom
U$1  59.04,72.12 180 bottom
U$8  134.13,81.14 270 bottom
X1  136.7,55.1 90 bottom
X2  155.06,71.93 90 bottom
X3  154.94,46.99 90 bottom
X4  7,46 90 bottom
X5  7,57 90 bottom
X6  90,103 0 bottom
X7  155.1,92.1 90 bottom

### Tracks (layer width: path | path; a pad name or v marks a point on that pad's centre or on a via)
1A
  Bottom 0.813: X6.5 89.25,98.4 JP2.4
1B
  Bottom 0.813: JP2.5 91.79,98.21 88.25,101.75 X6.4
2A
  Bottom 0.813: JP2.3 86.71,97.79 84.5,100 83.5,100 81.25,102.25 X6.6
2B
  Bottom 0.813: JP2.6 94.33,98.17 91.75,100.75 X6.3
BTN-1
  Top 0.508: BUTTON3.3 119.28,35.22 117.92,36.59 99.92,36.59 99.08,37.41 R29.1 98.08,38.62 97.2,39.5 97.2,42.9 94.8,45.3 69.2,45.3 60.31,54.19 U$1.D34
BTN-2
  Top 0.508: BUTTON4.3 136.93,36.97 135.9,38 102.8,38 102.17,38.62 102.12,38.62 | U$1.D36 62.85,53.65 69.9,46.6 99.9,46.6 103,43.5 103,39.5 102.12,38.62 | R28.1 102.12,38.62
BTN-3
  Top 0.508: BUTTON5.3 154.21,33.7 151.5,31 101.5,31 96,36.5 96,40 95.62,40.38 R27.1 94.46,42.34 92.9,43.9 68.1,43.9 57.77,54.23 U$1.D32
BTN-4  (via drill 0.55)
  Top 0.508: BUTTON2.3 19.2,78.7 21.95,81.45 R26.1 23.79,96.79 24.5,97.5 26.5,97.5 v27,97
  Bottom 0.508: U$1.D3 39.99,95.51 38.5,97 v27,97
BTN-5  (via drill 0.55)
  Top 0.508: BUTTON1.3 17.55,100.55 18.5,101.5 21,101.5 21.95,100.55 R25.1 23.75,99.25 24.5,98.5 26.5,98.5 v27,99
  Bottom 0.508: U$1.D5 42.53,96.47 40.25,98.75 40,99 v27,99
BUZ-5V  (via drill 0.55)
  Top 0.508: v55,88 56,87 56,85 65.4,75.6 65.4,62.5 64.1,61.2 64.1,54.9 v69,50 | R21.2 84.85,32.65 80,37.5 v80,39
  Bottom 0.508: U$1.D11 51.4,91.19 51.4,88.8 52.2,88 v55,88 | v80,39 v69,50
BUZ-12V  (via drill 0.55)
  Top 0.508: U$1.D13 52.69,93.59 55.2,96.1 60.8,96.1 63.8,99.1 76.8,99.1 78.2,100.5 103.3,100.5 103.7,100.9 110.3,100.9 113.5,97.7 v113.5,95 | v112.5,65.5 112.5,87 v113,87.5
  Bottom 0.508: v112.5,65.5 112.5,62 114,60.5 118.5,60.5 121.91,57.09 R22.2 | v113,87.5 113.5,88 v113.5,95
DHT
  Bottom 0.508: U$1.D7 43.8,91.17 43.8,88.3 43,87.5 5,87.5 2.5,85 2.5,50.5 4.46,48.54 X4.3
DIR
  Top 0.508: U$1.D45 69,63.43 69,77.6 74.9,83.5 81.24,83.5 JP1.8
EN
  Top 0.508: U$1.D43 71.69,58.2 76.8,58.2 77.6,59 77.6,63.1 79,64.5 79,72 80,73 91.5,73 99.27,80.77 JP1.1
GND  (via drill 0.55)
  Top 0.813: U1.9 108.66,84.34 109.5,83.5 109.5,78.5 | 109.5,78.5 108.79,77.79 U2.15 | 109.5,78.5 109.5,73.5 108.71,72.71 | U2.13 108.71,72.71 | 108.71,72.71 109.5,71.93 109.5,68 109.13,67.63 U2.11 109.3,65.79 109.3,59.4 108.02,58.12 U3.8 109,56.2 109,54 108.04,53.04 U3.6 108.8,51.32 108.8,49.2 | 108.8,49.2 107.56,47.96 U3.4 | U3.2 108.38,42.88 109,43.5 109,49 108.8,49.2 | v98.6,68 98.4,67.8 98.4,60.1 95.8,57.5 93,57.5 92,56.5 v92,55 | U$8.OUT- 142.77,59.77 141.3,58.3 122.9,58.3 121.2,60 121.2,75.2 124.2,78.2 R40.2 | v101.1,42 101.12,41.98 R28.2 | C4.2 v115.8,19.2 | R27.2 94.5,38.63 v94.5,37 | v100.1,15.6 100.1,13.91 C3.2 100.31,13.71 102.88,13.71 IC5.15
  Bottom 0.813: U1.15 107.86,99.58 109,98.44 109,95.5 | 109,95.5 108,94.5 U1.13 | U1.11 107.42,89.42 109,91 | 109,91 109,95.5 | U1.9 109,85.97 109,91 | U3.2 101.98,42.88 v101.1,42 | U3.8 106.96,58 99.9,58 96.52,54.62 IC1.7 92.38,54.62 v92,55 | IC4.7 96.92,68 v98.6,68
  other vias: 7.5,34
  pour Top (isolate 0.61): 0,107.5 160,107.5 160,0 0,0
  pour Bottom (isolate 0.61): 0,107.5 92.5,107.5 92.5,89 103.5,89 103.5,29 160,29 160,0 0,0
GND-ISO
  Top 0.813: U1.6 116.58,89.42 117.5,88.5 117.5,85.5 116.34,84.34 U1.8
  Top 1.27: X3.1 152.01,39.99 150.28,41.72 150.28,49.5 | U2.4 116.29,72.71 118,71 118,66 | X7.1 152.85,90.35 151.48,88.98 151.48,50.7 150.28,49.5 | 150.28,49.5 125.5,49.5 118,57 118,66 | U2.6 116.37,67.63 118,66
  Bottom 1.27: JP2.7 96.87,99.63 95.25,101.25 X6.2 | U$8.IN- 145.55,100.95 148,98.5 148,93 150.65,90.35 X7.1
  pour Bottom (isolate 0.406): 160,107.5 94,107.5 94,90.5 105,90.5 105,30.5 160,30.5
L-IN1
  Bottom 0.508: U1.16 103,97.75 103,82 100.5,79.5 94.7,79.5 92.5,77.3 92.5,75 91.94,74.44 IC4.13 85.94,74.44 82.71,71.21 R2.2
L-IN2
  Bottom 0.508: U1.14 104,93.67 104,81.3 100.9,78.2 95,78.2 93.5,76.7 93.5,72.5 92.9,71.9 IC4.11 87.4,71.9 84.86,69.36 R3.2
L-IN3
  Bottom 0.508: U1.12 106.96,91.96 105,90 105,80.5 101.5,77 95.4,77 94.5,76.1 94.5,70.5 93.36,69.36 IC4.9 88.86,69.36 87.83,68.33 R5.1
L-IN4
  Bottom 0.508: U1.10 106,85.51 106,80 101.71,75.71 101.6,75.71 | IC4.1 101.6,75.71 | R6.1 100.91,72.91 101.6,73.6 101.6,75.71
L-IN5
  Bottom 0.508: U2.16 108.67,80.33 109.5,79.5 109.5,77.5 108.5,76.5 105.5,76.5 103.5,74.5 103.5,68.5 101.5,66.5 91.5,66.5 90.6,65.6 90.6,61.4 90.17,60.97 IC1.13 82.47,60.97 80.53,59.02 R10.2
L-IN6
  Bottom 0.508: R11.2 82.54,56.54 84.43,58.43 IC1.11 90.43,58.43 91.7,59.7 91.7,64.4 92.6,65.3 102.8,65.3 104.8,67.3 104.8,73.8 106.25,75.25 U2.14
L-IN7
  Bottom 0.508: U2.12 107.17,70.17 106,69 106,66 104,64 93.5,64 92.8,63.3 92.8,58.1 90.59,55.89 IC1.9 85.39,55.89 84.57,55.07 R23.2
L-O1
  Bottom 0.508: R1.2 149.82,79.82 150.5,80.5 150.68,80.68 X2.7
L-O2
  Bottom 0.508: R4.1 150.43,77.57 150.82,77.18 X2.6
L-O3
  Bottom 0.508: R7.1 149.3,75.2 150.82,73.68 X2.5
L-O4
  Bottom 0.508: R8.1 149.26,72.74 151.82,70.18 X2.4
L-O5
  Bottom 0.508: R9.2 148.85,70.15 152.32,66.68 X2.3
L-O6
  Bottom 0.508: R12.1 148.89,67.61 153.32,63.18 X2.2
L-O7
  Bottom 0.508: R24.1 147.05,63.45 150.82,59.68 X2.1
LCD-D2
  Top 0.508: DS1.4 41.81,100.81 38.7,97.7 38.7,91.1 39.9,89.9 U$1.D2
LCD-D3
  Top 0.508: DS1.6 46.89,102.07 43.91,99.09 43.62,98.8 41.2,96.38 41.2,91.23 U$1.D4
LCD-D4
  Top 0.508: U$1.D6 43.8,91.17 43.8,96.9 48.3,101.4 58.22,101.4 DS1.11
LCD-D5
  Top 0.508: U$1.D8 46.4,91.11 46.4,96.9 49.6,100.1 59.1,100.1 61.77,102.77 DS1.12
LCD-D11
  Top 0.508: U$1.D10 48.9,91.15 48.9,96.1 51.6,98.8 59.7,98.8 62.2,101.3 63.6,101.3 64.67,102.37 DS1.13
LCD-D12
  Top 0.508: U$1.D12 51.4,91.19 51.4,94.9 54,97.5 60.2,97.5 62.9,100.2 65.7,100.2 67.21,101.71 DS1.14
LED-1
  Bottom 0.508: U$1.D40 67.93,55.43 55.1,42.6 55.1,37.9 57.42,35.58 LED1.A
LED-2  (via drill 0.55)
  Top 0.508: U$1.D42 70.47,56.53 72.6,54.4 83.9,54.4 85.4,55.9 85.4,63.2 86.2,64 95,64 96.5,62.5 v97,62.5 | v127.5,63.5 128,63.5 129.24,64.74 LED2.A
  Bottom 0.508: v97,62.5 105,62.5 106.3,63.8 108.9,63.8 114,68.9 122.1,68.9 v127.5,63.5
LED-3
  Bottom 0.508: U$1.D44 73.01,56.51 70.5,54 68.5,54 56.5,42 56.5,39 58,37.5 74,37.5 75.61,35.89 LED3.A
LED-4  (via drill 0.55)
  Top 0.508: LED4.A 120.34,21.66 119,23 103.5,23 89.5,37 88,37 86.5,38.5 v86.5,39
  Bottom 0.508: U$1.D46 75.55,51.95 86.5,41 v86.5,39
LED-5
  Bottom 0.508: LED5.A 34.29,37.21 32,39.5 32,61 33,62 68.5,62 69.2,61.3 69.2,58.8 69.8,58.2 74.33,58.2 U$1.D47
LED-6
  Bottom 0.508: U$1.D48 75.55,61.85 74.4,60.7 71.8,60.7 71,61.5 71,61.51 69.31,63.2 31.7,63.2 30.5,62 30.5,40 28,37.5 17,37.5 15.24,35.74 LED6.A
LIM-B1  (via drill 0.55)
  Top 0.508: v85.5,72 85,71.5 v81.5,71.5
  Bottom 0.508: IC4.12 86.67,73.17 v85.5,72 | v81.5,71.5 77.5,75.5 77.5,91.44 76.5,92.44 U$1.D31
LIM-B2  (via drill 0.55)
  Top 0.508: v88,70.5 87.5,70 v80.5,70
  Bottom 0.508: IC4.10 88.13,70.63 v88,70.5 | v80.5,70 75.5,75 75.5,89.85 U$1.D30
LIM-B3  (via drill 0.55)
  Top 0.508: v80.5,68 81,67.5 v89,67.5
  Bottom 0.508: IC4.8 90.6,68 89.5,68 v89,67.5 | v80.5,68 74.2,74.3 74.2,87.3 73,88.5 73.01,88.51 U$1.D28
LIM-B4  (via drill 0.55)
  Top 0.508: v82.5,63.5 84,63.5 85.5,65 95,65 96.5,66.5 96.5,72.5 98,74 v99.5,74
  Bottom 0.508: IC4.2 99.06,74.44 v99.5,74 | U$1.D26 70.47,88.53 72.5,86.5 72.5,73.5 v82.5,63.5
LIM-CTR  (via drill 0.55)
  Top 0.508: U$1.D21 62.85,93.95 65.7,96.8 78.4,96.8 79.6,98 102.8,98 105.1,95.7 109,95.7 111,93.7 v111,64.5 | v97,60.5 92,60.5 90.7,59.2 90.7,53.2 v89.5,52
  Bottom 0.508: v97,60.5 109.4,60.5 111,62.1 v111,64.5 | v89.5,52 87.3,52 86.5,52.8 86.5,54 87.12,54.62 IC1.8
LIM-S1  (via drill 0.55)
  Top 0.508: v80.5,62 80.5,60 v82,58.5
  Bottom 0.508: IC1.12 83.2,59.7 v82,58.5 | v80.5,62 80.5,63.5 78.2,65.8 72.2,65.8 71,67 71,85.5 67.93,88.57 U$1.D24
LIM-S2  (via drill 0.55)
  Top 0.508: v79,59 79,58.5 81,56.5 v84,56.5
  Bottom 0.508: IC1.10 84.66,57.16 v84,56.5 | U$1.D22 65.39,88.61 69.5,84.5 69.5,65 71.3,63.2 77.8,63.2 79,62 v79,59
MISO
  Top 0.508: U$1.D50 76.5,64.5 77.5,65.5 77.5,73 79,74.5 90.5,74.5 96.73,80.73 JP1.2
MOSI
  Top 0.508: U$1.D51 71.45,66.06 71.45,75.65 74.8,79 86.5,79 89.11,81.61 JP1.5
N$1
  Top 0.508: IC5.5 110.92,17.41 110.92,17.43 C1.1
N$2
  Top 0.508: IC5.6 110.19,18.68 110.7,19.2 C4.1
N$3
  Top 0.508: C2.1 111.39,14.88 111.38,14.88 IC5.3
N$4
  Top 0.508: IC5.1 110.73,12.34 111.9,13.5 114,13.5 114.24,13.74 C2.2
N$5
  Top 0.508: IC5.4 111,16.14 111.27,16.14 113.64,16.14 114.12,16.62 C1.2
N$6
  Top 0.508: IC5.14 104.25,14.88 105,14.12 105,11 103.9,9.9 103.9,8.8 104.4,8.3 105.1,8.3 105.18,8.38 J1.2
N$7
  Top 0.508: IC5.2 107.98,13.61 107.25,12.88 107.25,11.75 108,11 112.2,11 112.62,11.42 C5.1
N$8
  Top 0.508: LED1.K 50.85,34.65 46.99,38.51 R30.2
N$9
  Top 0.508: R33.2 119,15.5 122,15.5 122.88,16.38 LED4.K
N$10
  Top 0.508: IC5.13 104.73,16.14 106.12,14.75 106.12,10.88 107.95,9.05 J1.3
N$13
  Bottom 0.508: R1.1 126.18,79.82 121.2,84.8 121.2,97.8 119.5,99.5 117.6,99.5 U1.1
N$14
  Bottom 0.508: R4.2 126.43,77.57 119.5,84.5 119.5,93.5 115.96,97.04 U1.3
N$15
  Bottom 0.508: R7.2 126.8,75.2 118,84 118,89.5 115.54,91.96 U1.5
N$16
  Bottom 0.508: R8.2 126.76,72.74 116.5,83 116.5,85 114.98,86.52 U1.7
N$23
  Bottom 0.508: U2.1 116.67,80.33 128.5,68.5 137.4,68.5 139.05,70.15 R9.1
N$24
  Bottom 0.508: U2.3 119.75,75.25 127.9,67.1 138.33,67.1 139.9,68.67 143.33,68.67 144.39,67.61 R12.2
N$25
  Top 0.508: R21.1 86.55,29.05 87.55,30.05 89.8,30.05 90.46,29.39 Q1.1
N$33
  Bottom 0.508: U3.16 116.84,40.34 119.5,43 134,43 136.74,45.74 R14.2
N$37
  Bottom 0.508: R15.2 134.2,46.2 132.5,44.5 117.5,44.5 116.58,45.42 U3.14
N$38
  Bottom 0.508: R17.1 131.66,46.96 130.7,46 127,46 121.4,51.6 115.8,51.6 U3.12
N$39
  Bottom 0.508: U3.10 120.42,55.58 127.34,48.66 R18.1
N$42
  Top 0.508: Q1.3 89.51,20.37
  Top 0.813: 89.51,20.37 LS1.-
N$47
  Bottom 0.508: Q2.3 136.67,56.34 X1.2
N$56
  Top 0.508: R36.1 36.79,98.29 39.27,100.77 DS1.3
N$66
  Bottom 0.508: Q2.1 R22.1
N$69
  Bottom 0.508: U2.5 122.83,70.17 127.5,65.5 138.23,65.5 140.6,63.13 144.13,63.13 145.35,64.35 R24.2
N$89
  Top 0.508: R31.2 133.22,75.22 131.78,73.78 LED2.K
N$91
  Top 0.508: R32.2 59.71,39.79 65.17,34.34 LED3.K
N$94
  Top 0.508: R34.2 44.45,38.45 40.29,34.29 LED5.K
N$96
  Top 0.508: R35.2 41.91,38.41 40.5,37 27,37 24.29,34.29 LED6.K
R-O1
  Bottom 0.508: U3.15 113,41.18 113,40 114,39 118.5,39 121,41.5 137,41.5 149.49,53.99 X3.5
R-O2
  Bottom 0.508: U3.13 113.46,47.96 112,46.5 112,39.5 113.5,38 119,38 121.5,40.5 138,40.5 148,50.5 X3.4
R-O3
  Bottom 0.508: U3.11 113.54,53.04 111,50.5 111,38.5 112.5,37 120,37 122.5,39.5 139,39.5 146.49,46.99 X3.3
R-O4
  Bottom 0.508: U3.9 112.62,58.12 110,55.5 110,38 112,36 121,36 123.5,38.5 140,38.5 144.99,43.49 X3.2
RL-1  (via drill 0.55)
  Top 0.508: U$1.D23 65.39,94.39 66.5,95.5 77.5,95.5 81,92 103,92 105.7,89.3 105.7,54.2 v100,48.5 99.8,48.3 R13.1
  Bottom 0.508: v100,48.5 100,46.5 102.4,44.1 108.3,44.1 109,43.4 109,41 108.34,40.34 U3.1
RL-2  (via drill 0.55)
  Top 0.508: U$1.D25 67.93,92.93 69.3,94.3 76.7,94.3 80.5,90.5 102.5,90.5 104.3,88.7 104.3,55.3 v99.5,50.5 99,50.01 R16.2
  Bottom 0.508: v99.5,50.5 100.4,50.5 101.7,49.2 101.7,47.3 103.58,45.42 U3.3
RL-3  (via drill 0.55)
  Top 0.508: R19.2 98.27,51.77 v99,52.5 103,56.5 103,86.3 101.2,88.1 72.3,88.1 71.7,88.7 71.7,91.13 U$1.D29
  Bottom 0.508: v99,52.5 104.5,52.5 106.5,50.5 U3.5
RL-4  (via drill 0.55)
  Top 0.508: U$1.D27 69.2,91.17 69.2,88.7 71.1,86.8 100.6,86.8 101.6,85.8 101.6,57.6 v98.5,54.5 97.53,53.53 R20.2
  Bottom 0.508: v98.5,54.5 104.5,54.5 105.58,55.58 U3.7
RST
  Top 0.508: U$1.D15 55.23,93.33 56.7,94.8 61.5,94.8 64.7,98 77.7,98 79,99.3 103.3,99.3 104.3,98.3 108.5,98.3 112.2,94.6 112.2,92 113.4,90.8 130.1,90.8 132.4,93.1 | R40.1 139.2,78.2 140,79 140,90 138.5,91.5 134,91.5 132.4,93.1 | BUTTON6.3 132.4,93.1
RX-DB9  (via drill 0.55)
  Top 0.508: IC5.12 100.58,17.41 99,19 99,23 89.5,32.5 87.5,32.5 82.5,37.5 v82.5,39 | U$1.D17 59,91.21 59,86.5 67.8,77.7 67.8,62.3 69.2,60.9 69.2,54.8 70.5,53.5 71.5,53.5 72.8,52.2 72.8,51.1 71.7,50 v71.5,50
  Bottom 0.508: v71.5,50 v82.5,39
RX-PWR
  Bottom 0.508: U$1.D19 59,91.13 59,87.5 57.8,86.3 13.7,86.3 9.5,82.1 9.5,59 8.77,58.27 X5.3
SCK
  Top 0.508: JP1.3 94.19,81.19 89,76 78,76 75.55,73.55 U$1.D52
SPDT-1
  Top 0.508: SWITCH5.P$2 139.97,22.03 137.5,24.5 104,24.5 91,37.5 91,39.5 91.88,40.38 R39.1 92.55,40.95 90.8,42.7 66.8,42.7 56.5,53 56.5,58.15 U$1.D33
SPDT-2  (via drill 0.55)
  Top 0.508: SWITCH1.P$2 24.5,16.5 27,19 27,26.5 31.87,31.37 R37.1 41.09,33.09 v42.5,34.5
  Bottom 0.508: U$1.D35 59,58.11 59,54 45,40 45,37 v42.5,34.5
SPDT-3  (via drill 0.55)
  Top 0.508: SWITCH2.P$2 42.95,16.49 45,18.54 45,30.3 43.93,31.37 R42.1 43.05,33.05 v43.5,33.5
  Bottom 0.508: U$1.D37 61.6,58.17 61.6,54.8 46.2,39.4 46.2,36.2 v43.5,33.5
SPDT-4  (via drill 0.55)
  Top 0.508: SWITCH3.P$2 48.51,16.49 46.5,18.5 46.5,30.3 47.57,31.37 R38.1 48.51,32.49 v47.5,33.5
  Bottom 0.508: U$1.D39 64.1,58.13 64.1,55.5 47.5,38.9 v47.5,33.5
SPDT-5  (via drill 0.55)
  Top 0.508: SWITCH4.P$2 68.01,16.49 66,18.5 66,27 61.63,31.37 R41.1 50.47,32.53 v48.5,34.5
  Bottom 0.508: U$1.D41 66.7,58.19 66.7,56.2 48.5,38 v48.5,34.5
SS
  Top 0.508: U$1.D53 73.01,71.01 73,71.02 73,74.7 75.8,77.5 87.5,77.5 91.65,81.65 JP1.4
STEP
  Top 0.508: U$1.D49 70.3,64.67 70.3,76.7 74.1,80.5 82.5,80.5 84.03,82.03 JP1.7
TX-DB9  (via drill 0.55)
  Top 0.508: IC5.11 101.31,18.68 100.5,19.5 100.5,24 90,34.5 88,34.5 84.5,38 v84.5,39.5 | U$1.D16 57.77,85.73 66.6,76.9 66.6,55.4 70,52 v71,52
  Bottom 0.508: v84.5,39.5 72,52 v71,52
TX-PWR
  Bottom 0.508: U$1.D18 60.31,86.81 58.5,85 14.6,85 11,81.4 11,57 9.73,55.73 X5.2
VCC  (via drill 0.55)
  Top 0.813: 29.83,96.83 29.83,103.33 32.5,106 | 29.83,96.83 U$1.+5V.2 | 71.4,106 38.5,106 | 38.5,106 32.5,106 | BUTTON1.1 11.48,89.98 | X4.2 3.5,46 2.5,47 2.5,52 3.69,53.19 X5.1 3.81,53.19 2,55 2,65.4 10.3,73.7 | X4.2 4.5,46 2.5,44 2.5,16.7 9.71,9.49 SWITCH1.P$1 SWITCH2.P$1 SWITCH3.P$1 SWITCH4.P$1 75.34,6.16 76.99,4.51 88.49,4.51 | 139,26 136.93,28.07 BUTTON4.1 | 139,26 121.8,26 BUTTON3.1 | DS1.15 69.75,104.35 71.4,106 | 32.5,106 15,106 11.48,102.48 11.48,89.98 | DS1.2 36.73,104.23 38.5,106 | X4.2 15,46 19.51,41.49 R35.1 R34.1 R30.1 R32.1 v88.99,41.49 v89,41.5 | 88.49,4.51 90.5,2.5 114.6,2.5 115.8,3.7 | R16.1 R19.1 R20.1 94.81,54.31 96,55.5 97,55.5 100.1,58.6 v100.1,68 | R16.1 94.82,48.32 R13.2 | v86.9,62.2 v87,50.5 87.5,50.01 R16.1 | 71.4,106 134.5,106 137.4,103.1 BUTTON6.1 140.55,94.95 142,93.5 142,76.5 140.72,75.22 R31.1 137.86,64.36 134.83,61.33 U$8.OUT+ | R33.1 117.08,13.08 116,12 | 116,12 C5.2 | IC5.16 102.88,12.23 100.19,12.23 C3.1 97.32,12.18 95.96,13.54 95.96,14 | 95.96,14 LS1.+ | 95.96,14 93.96,12 90,12 88.49,10.49 88.49,4.51 | 116,12 115.8,11.8 115.8,3.7 | 115.8,3.7 116.1,4 145.7,4 146.97,5.27 SWITCH5.P$1 147,14 147,24.5 145.5,26 | 10.3,73.7 9,75 9,87.5 11.48,89.98 | 139,26 145.5,26 | 145.5,26 147,27.5 153.5,27.5 154.21,28.2 BUTTON5.1 | R36.2 31.29,98.29 29.83,96.83 | 10.3,73.7 BUTTON2.1
  Bottom 0.508: IC1.14 87.26,62.24 v86.9,62.2
  Bottom 0.813: U$1.VIN.1 U$1.VIN.2 24.75,94.25 25.5,95 29,95 29.83,94.17 U$1.+5V.2 U$1.+5V.1 | DS1.15 69.75,101.75 71,100.5 78,100.5 80,98.5 83,98.5 84.17,97.33 JP2.2 84.17,93.17 83,92 80.1,92 79,90.9 79,77.5 80.79,75.71 IC4.14 | v100.1,68 100.1,69.36 R6.2 | R2.1 R3.1 86.98,66.64 | 86.98,66.64 R5.2 | R10.1 R11.1 R23.1 84.57,51.43 85.5,50.5 v87,50.5 88.5,50.5 91,48 91,43.5 v89,41.5 | IC1.14 88.69,63.81 86.98,65.52 86.98,66.64
VCC-ISO
  Bottom 1.27: R14.1 R15.1 R17.2 R18.2 | R14.1 140.86,50.36 147.5,57 156.5,57 158.5,59 158.5,82.5 156.82,84.18 | X1.1 136.7,50.4 R14.1 | X7.2 157.15,93.85 158.5,92.5 158.5,85.86 156.82,84.18 | 100,102.9 100.9,102.9 103.83,105.83 123,105.83 125.49,103.33 U$8.IN+ 125.49,99.99 123.36,97.86 123.36,89.64 125.62,87.38 141.62,87.38 144.82,84.18 X2.8 156.82,84.18 | 100,102.9 X6.1 | JP2.8 99.41,102.31 100,102.9
(copper drawn outside any net)
  shapes: Top area x2

### Text on the board
tNames: GND
bNames: 2A | 1A | 1B | 2B | GND | VCC | +12V | VCC | GND | DIR | VCC | LIM1 | LIM2 | LIM3 | LIM4 | LIM5 | LIM6 | GND | LIM7 | RX | BUZZER | TX | RL1 | VCC | VCC | RL2 | DHT | RL3 | VCC | GND | RL4 | GND